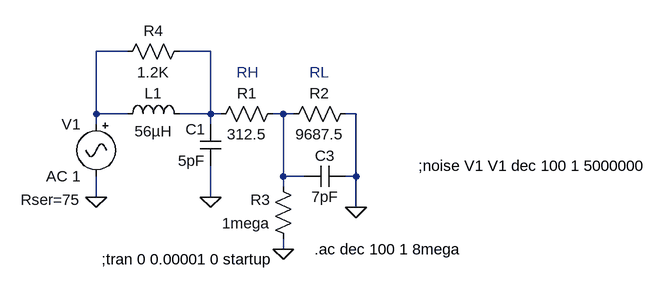
[diagram p0: schematic X9313WSIFrequencyCompensation.asc]
X9313WSIFrequencyCompensation.asc, the LTspice schematic file:
Version 4
SHEET 1 952 680
WIRE 0 16 -48 16
WIRE 128 16 80 16
WIRE -48 112 -48 16
WIRE 0 112 -48 112
WIRE 128 112 128 16
WIRE 128 112 80 112
WIRE 144 112 128 112
WIRE 240 112 224 112
WIRE 256 112 240 112
WIRE 352 112 336 112
WIRE -48 128 -48 112
WIRE 128 128 128 112
WIRE 240 208 240 112
WIRE 272 208 240 208
WIRE 352 208 352 112
WIRE 352 208 336 208
WIRE 240 224 240 208
WIRE -48 240 -48 208
WIRE 128 240 128 192
WIRE 352 256 352 208
WIRE 240 320 240 304
FLAG 352 256 0
FLAG -48 240 0
FLAG 128 240 0
FLAG 240 320 0
SYMBOL res 240 96 R90
WINDOW 0 0 56 VBottom 2
WINDOW 3 32 56 VTop 2
SYMATTR InstName R1
SYMATTR Value 312.5
SYMBOL res 352 96 R90
WINDOW 0 0 56 VBottom 2
WINDOW 3 32 56 VTop 2
SYMATTR InstName R2
SYMATTR Value 9687.5
SYMBOL cap 144 192 R180
WINDOW 0 24 56 Left 2
WINDOW 3 24 8 Left 2
SYMATTR InstName C1
SYMATTR Value 5pF
SYMATTR SpiceLine Rser=0.01
SYMBOL cap 336 192 R90
WINDOW 0 0 32 VBottom 2
WINDOW 3 32 32 VTop 2
SYMATTR InstName C3
SYMATTR Value 7pF
SYMATTR SpiceLine Rser=0.01
SYMBOL res 256 320 R180
WINDOW 0 36 76 Left 2
WINDOW 3 36 40 Left 2
SYMATTR InstName R3
SYMATTR Value 1mega
SYMBOL Misc\\signal -48 112 M0
WINDOW 123 0 0 Left 2
WINDOW 39 24 132 Left 2
SYMATTR InstName V1
SYMATTR Value AC 1
SYMATTR SpiceLine Rser=75
SYMBOL ind -16 128 R270
WINDOW 0 32 56 VTop 2
WINDOW 3 5 56 VBottom 2
SYMATTR InstName L1
SYMATTR Value 56µH
SYMATTR SpiceLine Rser=0.5
SYMBOL res -16 32 R270
WINDOW 0 32 56 VTop 2
WINDOW 3 0 56 VBottom 2
SYMATTR InstName R4
SYMATTR Value 1.2K
TEXT 168 48 Left 2 ;RH
TEXT 280 48 Left 2 ;RL
TEXT 288 320 Left 2 !.ac dec 100 1 8mega
TEXT -40 336 Left 2 !;tran 0 0.00001 0 startup
TEXT 448 192 Left 2 !;noise V1 V1 dec 100 1 5000000

The netlist it stands for:
* X9313WSIFrequencyCompensation.asc
R1 N003 N002 312.5
R2 0 N003 9687.5
C1 0 N002 5pF Rser=0.01
C3 0 N003 7pF Rser=0.01
R3 0 N003 1mega
V1 N001 0 AC 1 Rser=75
L1 N001 N002 56µH Rser=0.5
R4 N001 N002 1.2K
* RH
* RL
.ac dec 100 1 8mega
;tran 0 0.00001 0 startup
;noise V1 V1 dec 100 1 5000000
.backanno
.end